# EAGLE design US_balise_2 (EAGLE 5.11)
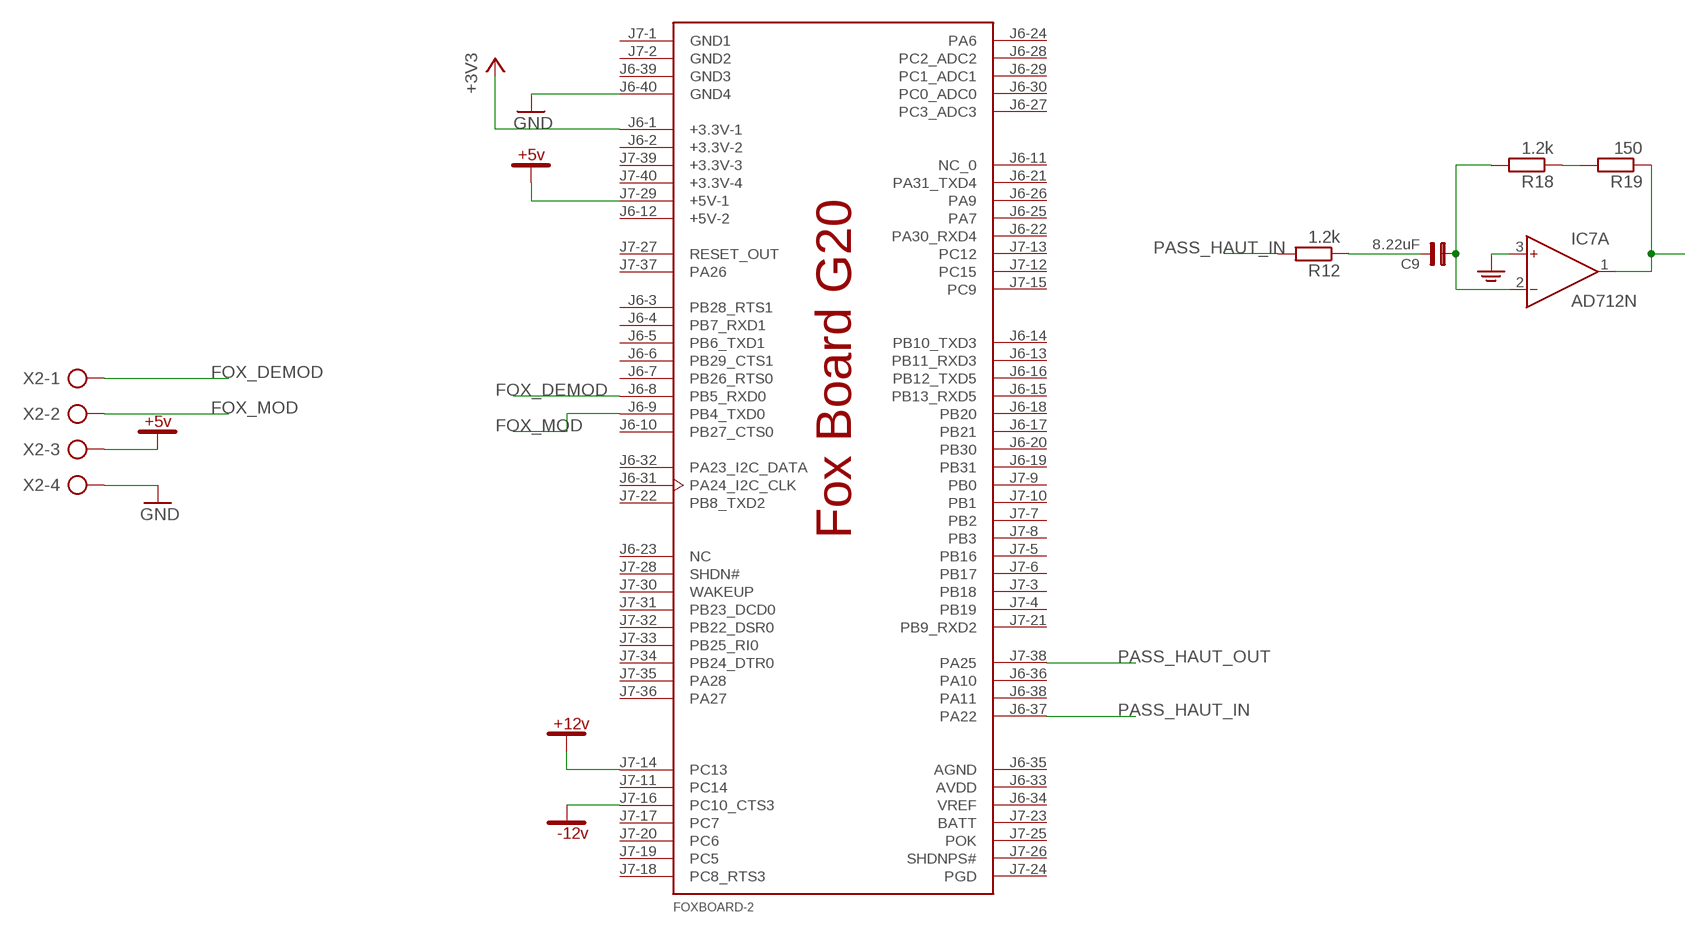
[diagram p0: schematic, sheet 1, part 1 of 2]
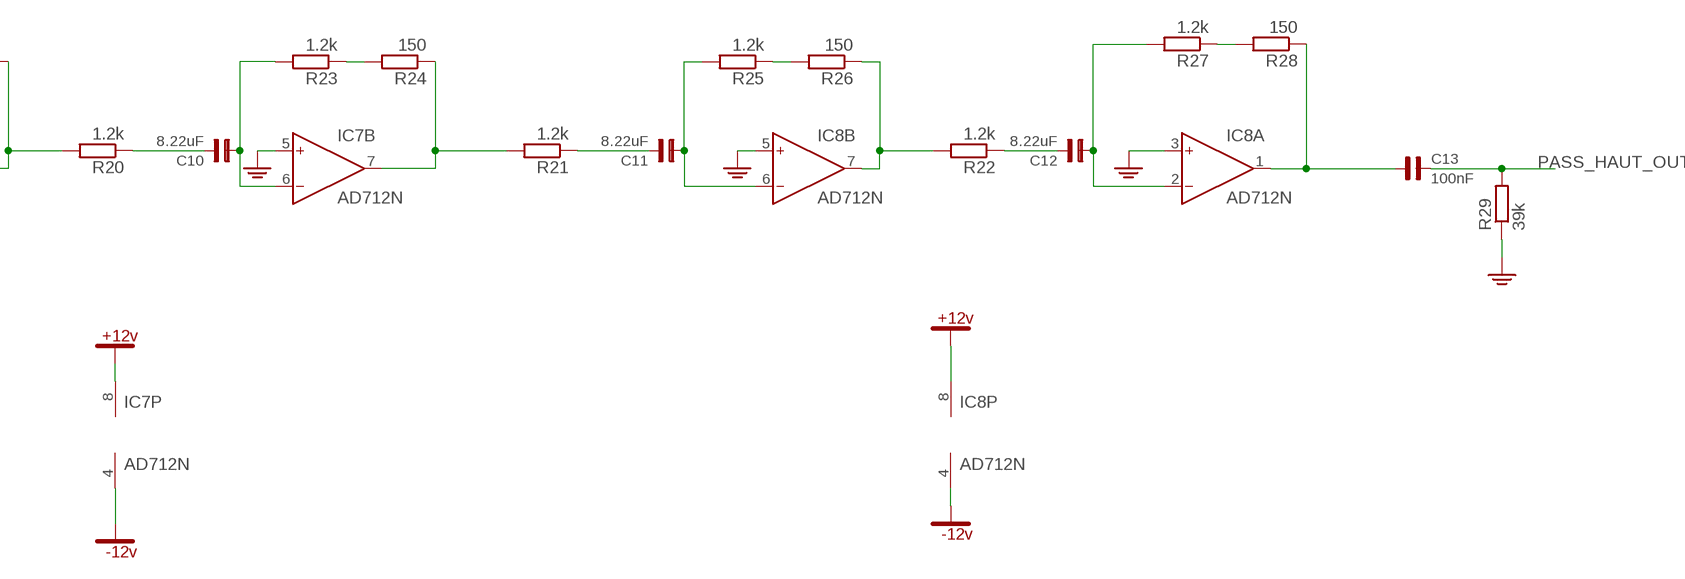
[diagram p1: schematic, sheet 1, part 2 of 2]

## Parts
C9  8.22uF  C5B2,5  [C5B2,5]
C10  8.22uF  C5B2,5  [C5B2,5]
C11  8.22uF  C5B2,5  [C5B2,5]
C12  8.22uF  C5B2,5  [C5B2,5]
C13  100nF  C5B2,5E  [C5B2,5A]
FOXBOARD-2  FOX-BOARD  [FOX-BOARD]
IC7  AD712N  [DIL08]
IC8  AD712N  [DIL08]
R12  1.2k  R-EU_0309/12  [0309/12]
R18  1.2k  R-EU_0309/12  [0309/12]
R19  150  R-EU_0309/12  [0309/12]
R20  1.2k  R-EU_0309/12  [0309/12]
R21  1.2k  R-EU_0309/12  [0309/12]
R22  1.2k  R-EU_0309/12  [0309/12]
R23  1.2k  R-EU_0309/12  [0309/12]
R24  150  R-EU_0309/12  [0309/12]
R25  1.2k  R-EU_0309/12  [0309/12]
R26  150  R-EU_0309/12  [0309/12]
R27  1.2k  R-EU_0309/12  [0309/12]
R28  150  R-EU_0309/12  [0309/12]
R29  39k  R-EU_0309/12  [0309/12]
X2  AK300/4  [AK300/4]

## Nets
+3V3: FOXBOARD-2.J6-1(+3.3V-1)
+5V: FOXBOARD-2.J7-29(+5V-1) X2.3
+12V: FOXBOARD-2.J7-14(PC13) IC7.8(P:V+) IC8.8(P:V+)
-12V: FOXBOARD-2.J7-16(PC10_CTS3) IC7.4(P:V-) IC8.4(P:V-)
FOX_DEMOD: FOXBOARD-2.J6-8(PB5_RXD0) X2.1
FOX_MOD: FOXBOARD-2.J6-9(PB4_TXD0) X2.2
GND: FOXBOARD-2.J6-40(GND4) IC7.3(A:IN+) IC7.5(B:IN+) IC8.3(A:IN+) IC8.5(B:IN+) R29.1 X2.4
N$23: C9.2 R12.1
N$25: C9.1 IC7.2(A:IN-) R18.2
N$27: R18.1 R19.2
N$28: IC7.1(A:OUT) R19.1 R20.2
N$29: C10.2 R20.1
N$30: C10.1 IC7.6(B:IN-) R23.2
N$31: R23.1 R24.2
N$33: IC7.7(B:OUT) R21.2 R24.1
N$34: C11.2 R21.1
N$35: C11.1 IC8.6(B:IN-) R25.2
N$36: R25.1 R26.2
N$37: IC8.7(B:OUT) R22.2 R26.1
N$38: C12.2 R22.1
N$39: C12.1 IC8.2(A:IN-) R27.2
N$40: R27.1 R28.2
N$41: C13.1 IC8.1(A:OUT) R28.1
PASS_HAUT_IN: FOXBOARD-2.J6-37(PA22) R12.2
PASS_HAUT_OUT: C13.2 FOXBOARD-2.J7-38(PA25) R29.2
Unconnected: FOXBOARD-2.J6-3(PB28_RTS1) FOXBOARD-2.J6-4(PB7_RXD1) FOXBOARD-2.J6-5(PB6_TXD1) FOXBOARD-2.J6-6(PB29_CTS1) FOXBOARD-2.J6-7(PB26_RTS0) FOXBOARD-2.J6-10(PB27_CTS0) FOXBOARD-2.J6-11(NC_0) FOXBOARD-2.J6-13(PB11_RXD3) FOXBOARD-2.J6-14(PB10_TXD3) FOXBOARD-2.J6-15(PB13_RXD5) FOXBOARD-2.J6-16(PB12_TXD5) FOXBOARD-2.J6-17(PB21) FOXBOARD-2.J6-18(PB20) FOXBOARD-2.J6-19(PB31) FOXBOARD-2.J6-20(PB30) FOXBOARD-2.J6-21(PA31_TXD4) FOXBOARD-2.J6-22(PA30_RXD4) FOXBOARD-2.J6-23(NC) FOXBOARD-2.J6-24(PA6) FOXBOARD-2.J6-25(PA7) FOXBOARD-2.J6-26(PA9) FOXBOARD-2.J6-27(PC3_ADC3) FOXBOARD-2.J6-28(PC2_ADC2) FOXBOARD-2.J6-29(PC1_ADC1) FOXBOARD-2.J6-30(PC0_ADC0) FOXBOARD-2.J6-31(PA24_I2C_CLK) FOXBOARD-2.J6-32(PA23_I2C_DATA) FOXBOARD-2.J6-33(AVDD) FOXBOARD-2.J6-34(VREF) FOXBOARD-2.J6-35(AGND) FOXBOARD-2.J6-36(PA10) FOXBOARD-2.J6-38(PA11) FOXBOARD-2.J7-3(PB18) FOXBOARD-2.J7-4(PB19) FOXBOARD-2.J7-5(PB16) FOXBOARD-2.J7-6(PB17) FOXBOARD-2.J7-7(PB2) FOXBOARD-2.J7-8(PB3) FOXBOARD-2.J7-9(PB0) FOXBOARD-2.J7-10(PB1) FOXBOARD-2.J7-11(PC14) FOXBOARD-2.J7-12(PC15) FOXBOARD-2.J7-13(PC12) FOXBOARD-2.J7-15(PC9) FOXBOARD-2.J7-17(PC7) FOXBOARD-2.J7-18(PC8_RTS3) FOXBOARD-2.J7-19(PC5) FOXBOARD-2.J7-20(PC6) FOXBOARD-2.J7-21(PB9_RXD2) FOXBOARD-2.J7-22(PB8_TXD2) FOXBOARD-2.J7-23(BATT) FOXBOARD-2.J7-24(PGD) FOXBOARD-2.J7-25(POK) FOXBOARD-2.J7-26(SHDNPS#) FOXBOARD-2.J7-27(RESET_OUT) FOXBOARD-2.J7-28(SHDN#) FOXBOARD-2.J7-30(WAKEUP) FOXBOARD-2.J7-31(PB23_DCD0) FOXBOARD-2.J7-32(PB22_DSR0) FOXBOARD-2.J7-33(PB25_RI0) FOXBOARD-2.J7-34(PB24_DTR0) FOXBOARD-2.J7-35(PA28) FOXBOARD-2.J7-36(PA27) FOXBOARD-2.J7-37(PA26)

## Power pins joined to a net without a drawn wire
+3.3V-2: FOXBOARD-2.J6-2(+3.3V-2)
+3.3V-3: FOXBOARD-2.J7-39(+3.3V-3)
+3.3V-4: FOXBOARD-2.J7-40(+3.3V-4)
+5V-2: FOXBOARD-2.J6-12(+5V-2)
GND1: FOXBOARD-2.J7-1(GND1)
GND2: FOXBOARD-2.J7-2(GND2)
GND3: FOXBOARD-2.J6-39(GND3)

## Library data of the parts
C9-C12 = CAP:C5B2,5
C13 = CAP:C5B2,5E
FOXBOARD-2 = Julien:FOX-BOARD
IC7 IC8 = analog-devices:AD712: Dual Precision, Low Cost, High Speed BiFET Op Amp Source: http://www.analog.com/static/imported-files/data_sheets/AD712.pdf; MF: ALTERA CORPORATION; MPN: AD712JNZ; OC_FARNELL: 9604898; OC_NEWARK: 59K4554
R12 R18-R29 = rcl:R-EU_: RESISTOR, European symbol
X2 = con-ptr500:AK300/4: CONNECTOR; OC_FARNELL: unknown; OC_NEWARK: unknown

## Board
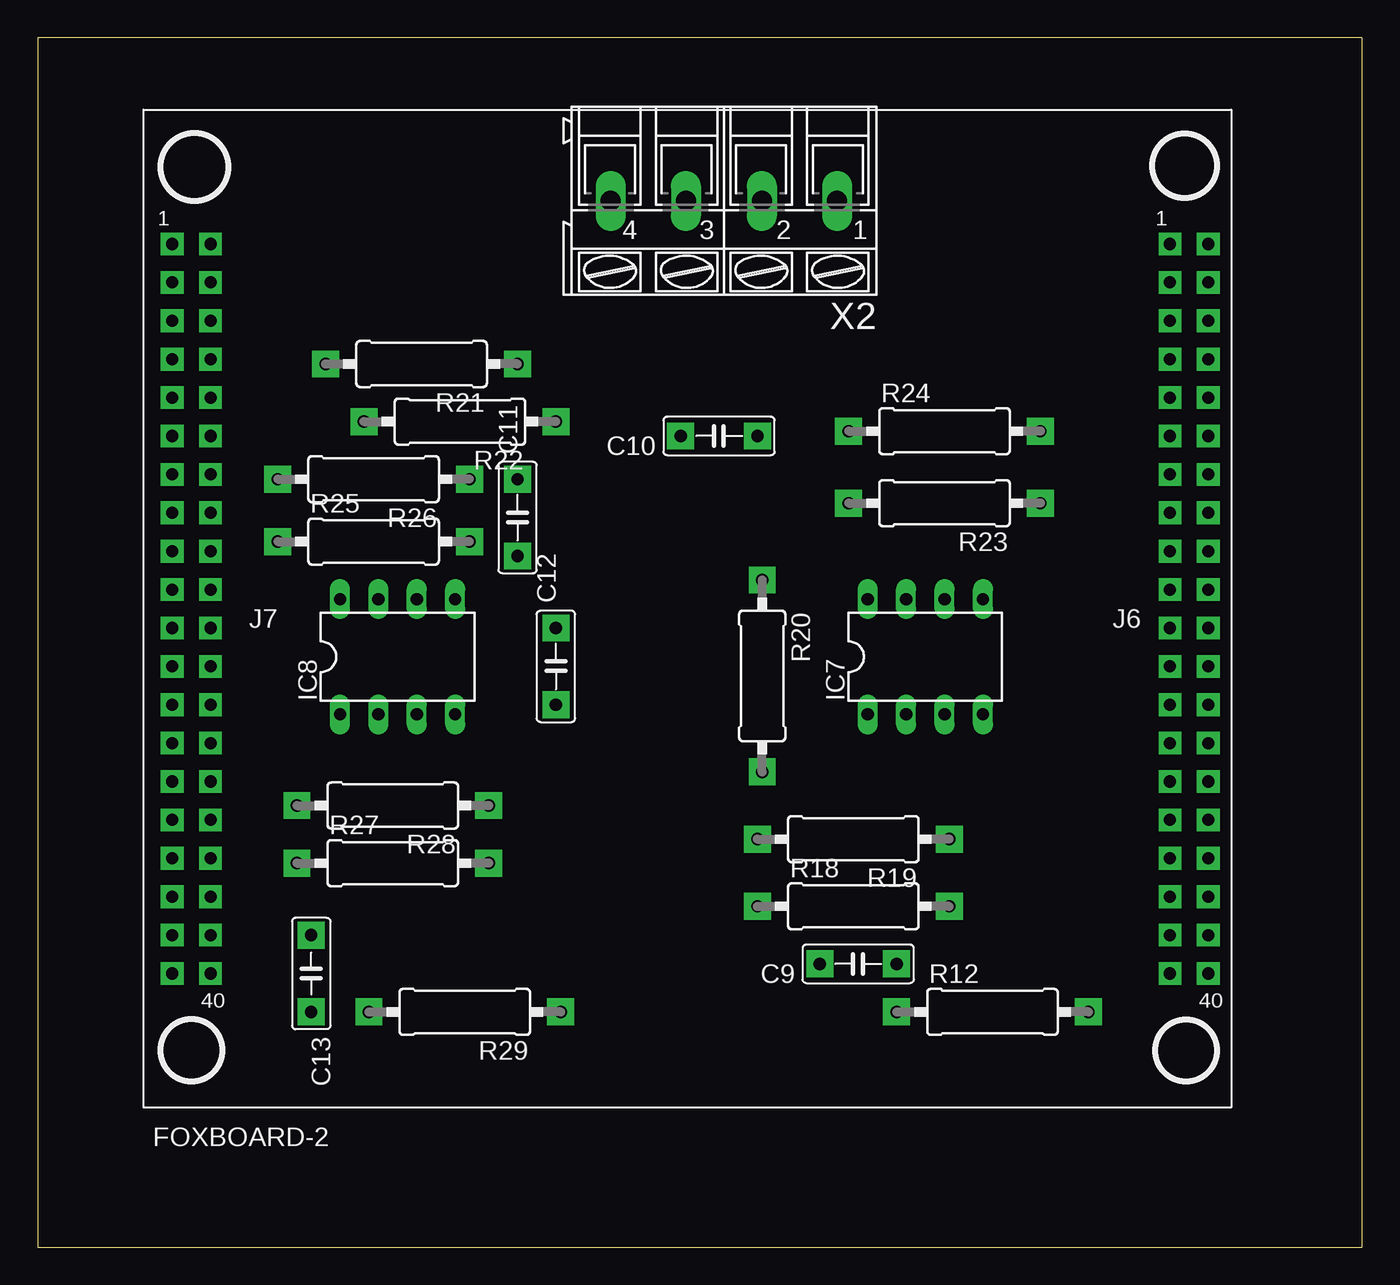
[diagram p2: board, top side]
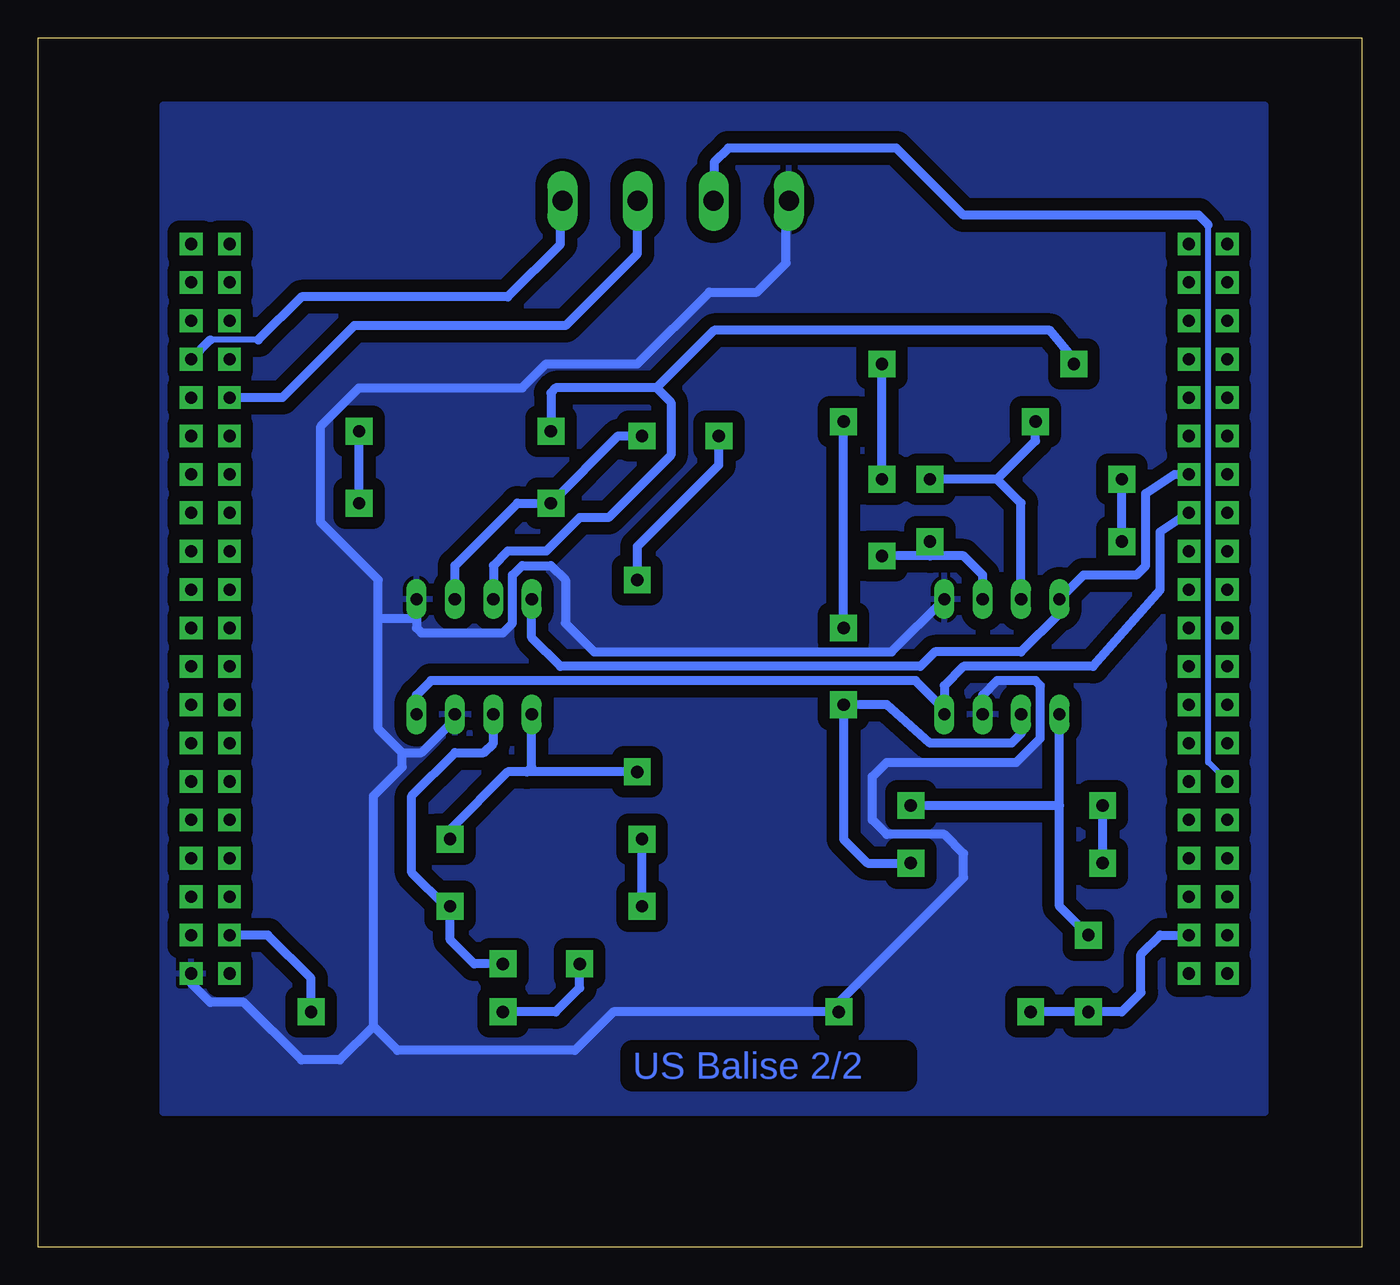
[diagram p3: board, bottom side, seen from below]

Size 87.62 x 80 mm. Coordinates in mm from the lower left corner, seen from the top.
Outline: 0,0 87.62,0 87.62,80 0,80 0,0
Copper layers (1*16): Top 0.035mm / dielectric 1.5mm / Bottom 0.035mm
Design rules "default": minimum track width 10mil, minimum drill 24mil, track to track 8mil, track to pad 8mil, pad to pad 8mil, via to via 8mil, smd to smd 8mil, copper to edge 40mil, drill to drill 8mil, minimum pad ring 10mil, minimum via ring 8mil, stop-mask expansion 4mil, vias tented up to drill 0mil, thermal gap 10mil

### Footprints (pad centres in the part's own frame; a part is rotated, then mirrored left to right if it is on the bottom)
C5B2,5 = drill 0.813 pad 1.778 square: 1 -2.54,0; 2 2.54,0
C5B2,5A = drill 0.813 pad 1.778 square: 1 -2.54,0; 2 2.54,0
FOX-BOARD = drill 0.8 pad 1.5 square: J6-1 31.75,22.86; J6-2 34.29,22.86; J6-3 31.75,20.32; J6-4 34.29,20.32; J6-5 31.75,17.78; J6-6 34.29,17.78; J6-7 31.75,15.24; J6-8 34.29,15.24; J6-9 31.75,12.7; J6-10 34.29,12.7; J6-11 31.75,10.16; J6-12 34.29,10.16; J6-13 31.75,7.62; J6-14 34.29,7.62; J6-15 31.75,5.08; J6-16 34.29,5.08; J6-17 31.75,2.54; J6-18 34.29,2.54; J6-19 31.75,0; J6-20 34.29,0; J6-21 31.75,-2.54; J6-22 34.29,-2.54; J6-23 31.75,-5.08; J6-24 34.29,-5.08; J6-25 31.75,-7.62; J6-26 34.29,-7.62; J6-27 31.75,-10.16; J6-28 34.29,-10.16; J6-29 31.75,-12.7; J6-30 34.29,-12.7; J6-31 31.75,-15.24; J6-32 34.29,-15.24; J6-33 31.75,-17.78; J6-34 34.29,-17.78; J6-35 31.75,-20.32; J6-36 34.29,-20.32; J6-37 31.75,-22.86; J6-38 34.29,-22.86; J6-39 31.75,-25.4; J6-40 34.29,-25.4; J7-1 -34.29,22.86; J7-2 -31.75,22.86; J7-3 -34.29,20.32; J7-4 -31.75,20.32; J7-5 -34.29,17.78; J7-6 -31.75,17.78; J7-7 -34.29,15.24; J7-8 -31.75,15.24; J7-9 -34.29,12.7; J7-10 -31.75,12.7; J7-11 -34.29,10.16; J7-12 -31.75,10.16; J7-13 -34.29,7.62; J7-14 -31.75,7.62; J7-15 -34.29,5.08; J7-16 -31.75,5.08; J7-17 -34.29,2.54; J7-18 -31.75,2.54; J7-19 -34.29,0; J7-20 -31.75,0; J7-21 -34.29,-2.54; J7-22 -31.75,-2.54; J7-23 -34.29,-5.08; J7-24 -31.75,-5.08; J7-25 -34.29,-7.62; J7-26 -31.75,-7.62; J7-27 -34.29,-10.16; J7-28 -31.75,-10.16; J7-29 -34.29,-12.7; J7-30 -31.75,-12.7; J7-31 -34.29,-15.24; J7-32 -31.75,-15.24; J7-33 -34.29,-17.78; J7-34 -31.75,-17.78; J7-35 -34.29,-20.32; J7-36 -31.75,-20.32; J7-37 -34.29,-22.86; J7-38 -31.75,-22.86; J7-39 -34.29,-25.4; J7-40 -31.75,-25.4
DIL08 = drill 0.813 long: 1 -3.81,-3.81; 2 -1.27,-3.81; 3 1.27,-3.81; 4 3.81,-3.81; 5 3.81,3.81; 6 1.27,3.81; 7 -1.27,3.81; 8 -3.81,3.81
0309/12 = drill 0.813 octagon: 1 -6.35,0; 2 6.35,0
AK300/4 = drill 1.321 long: 1 -7.493,0; 2 -2.515,0; 3 2.515,0; 4 7.493,0

### Placement (x,y rotation side)
C9  54.29,18.73 180 top
C10  45.09,53.66 180 top
C11  31.75,48.26 90 top
C12  34.29,38.42 90 top
C13  18.1,18.1 270 top
FOXBOARD-2  43.18,43.5 0 top
IC7  58.74,39.05 0 top
IC8  23.81,39.05 0 top
R12  63.18,15.56 0 top
R18  53.98,22.54 0 top
R19  53.98,26.99 180 top
R20  47.94,37.78 270 top
R21  25.4,58.42 180 top
R22  27.94,54.61 180 top
R23  60.01,49.21 180 top
R24  60.01,53.98 0 top
R25  22.23,46.67 0 top
R26  22.23,50.8 180 top
R27  23.5,25.4 0 top
R28  23.5,29.21 180 top
R29  28.26,15.56 180 top
X2  45.4,69.22 180 top

### Tracks (layer width: path | path; a pad name or v marks a point on that pad's centre or on a via)
+5V
  Bottom 0.406: FOXBOARD-2.J7-29 10.16,32.07 10.16,67.63
  Bottom 0.61: 10.16,67.63 10.79,68.26 26.35,68.26 30.8,72.71 41.91,72.71 42.86,71.75 42.86,69.24 X2.3
+12V
  Bottom 0.61: FOXBOARD-2.J7-14 12.38,51.12 14.29,49.85 14.29,45.09 14.92,44.45 18.41,44.45 IC8.8 20,41.91 22.54,39.37 28.26,39.37 29.21,38.42 53.02,38.42 54.93,40.32 IC7.8
-12V
  Bottom 0.406: IC8.4 27.62,35.56
  Bottom 0.61: 27.62,35.56 29.53,37.47 61.59,37.47 62.55,36.51 IC7.4 | IC8.4 27.62,37.15 26.35,38.42 17.78,38.42 13.34,43.5 13.34,47.31 FOXBOARD-2.J7-16
FOX_DEMOD
  Bottom 0.406: 73.03,60.01 76.2,60.01
  Bottom 0.61: 73.03,60.01 70.17,62.87 56.52,62.87 53.02,66.36 53.02,69.22 X2.1 | 76.2,60.01 FOXBOARD-2.J6-8
FOX_MOD
  Bottom 0.61: FOXBOARD-2.J6-9 71.44,56.2 66.67,60.96 52.7,60.96 47.94,65.72 47.94,69.19 X2.2
GND
  Bottom 0.61: IC8.3 25.08,36.51 24.13,37.47 21.59,37.47 21.27,37.15 21.27,33.66 22.86,32.07 31.43,32.07 32.38,31.11 32.38,28.26 31.43,27.3 27.62,27.3 26.35,26.04 26.35,24.45 34.61,16.19 R29.1 49.53,15.56 52.07,13.02 63.82,13.02 65.41,14.61 | IC8.5 31.11,39.37 50.8,39.37 52.7,41.27 52.7,44.13 53.66,45.09 55.56,45.09 56.2,44.45 56.2,41.27 56.83,40.64 62.23,40.64 62.55,40.96 62.55,41.59 | FOXBOARD-2.J6-40 77.47,17.46 76.2,16.19 73.98,16.19 70.17,12.38 67.63,12.38 65.41,14.61 | 63.5,32.7 63.5,31.75 65.41,29.84 65.41,14.61 | IC7.3 60.01,34.92 62.23,32.7 63.5,32.7 | 65.09,41.59 65.09,34.29 63.5,32.7 | 65.09,41.59 62.55,41.59 | 62.55,41.59 IC7.5 | 65.09,41.59 65.09,44.13 68.9,47.94 68.9,54.29 66.36,56.83 55.56,56.83 53.98,58.42 47.94,58.42 43.18,63.18 40.01,63.18 38.1,65.09 38.1,69.03 X2.4
  pour Bottom (isolate 0.813): 6.35,75.56 79.38,75.56 79.38,8.89 6.35,8.89
N$1  (via drill 0.5 pad 1.78)
  other vias: 34.61,15.56
N$2  (via drill 0.5 pad 1.78)
  other vias: 29.84,29.21
N$3  (via drill 0.5 pad 1.78)
  other vias: 21.91,15.56
N$4  (via drill 0.5 pad 1.78)
  other vias: 47.62,26.99
N$5  (via drill 0.5 pad 1.78)
  other vias: 17.14,29.21
N$6  (via drill 0.5 pad 1.78)
  other vias: 29.84,25.4
N$7  (via drill 0.5 pad 1.78)
  other vias: 17.14,25.4
N$8  (via drill 0.5 pad 1.78)
  other vias: 47.94,44.13
N$9  (via drill 0.5 pad 1.78)
  other vias: 47.62,53.66
N$10  (via drill 0.5 pad 1.78)
  other vias: 60.33,26.99
N$11  (via drill 0.5 pad 1.78)
  other vias: 60.33,22.54
N$12  (via drill 0.5 pad 1.78)
  other vias: 56.83,15.56
N$13  (via drill 0.5 pad 1.78)
  other vias: 47.62,22.54
N$14  (via drill 0.5 pad 1.78)
  other vias: 66.36,53.98
N$15  (via drill 0.5 pad 1.78)
  other vias: 19.05,58.42
N$16  (via drill 0.5 pad 1.78)
  other vias: 15.88,50.8
N$17  (via drill 0.5 pad 1.78)
  other vias: 21.59,54.61
N$18  (via drill 0.5 pad 1.78)
  other vias: 28.57,50.8
N$19  (via drill 0.5 pad 1.78)
  other vias: 28.57,46.67
N$20  (via drill 0.5 pad 1.78)
  other vias: 31.75,58.42
N$21  (via drill 0.5 pad 1.78)
  other vias: 34.29,54.61
N$22  (via drill 0.5 pad 1.78)
  other vias: 15.88,46.67
N$23
  Bottom 0.61: R12.1 53.34,15.56 51.75,17.14 C9.2
N$24  (via drill 0.5 pad 1.78)
  other vias: 18.1,20.64
N$25
  Bottom 0.61: C9.1 58.74,18.73 60.33,20.32 R18.2 60.64,22.54 62.87,24.77 62.87,29.84 60.01,32.7 58.1,32.7 57.47,33.34 IC7.2
N$26  (via drill 0.5 pad 1.78)
  other vias: 18.1,15.56
N$27
  Bottom 0.61: R18.1 R19.2
N$28
  Bottom 0.61: R19.1 60.33,27.62 56.52,31.43 55.24,31.43 | R20.2 55.24,31.43 | IC7.1 54.93,31.75 55.24,31.43
N$29
  Bottom 0.61: C10.2 42.55,51.75 47.94,46.35 R20.1
N$30
  Bottom 0.61: C10.1 49.21,53.66 R23.2 55.88,49.21 60.01,45.09 IC7.6
N$31
  Bottom 0.61: R23.1 R24.2
N$32  (via drill 0.5 pad 1.78)
  other vias: 69.53,15.56
N$33
  Bottom 0.406: R21.2 19.05,58.74
  Bottom 0.61: R24.1 53.66,56.52 53.34,56.83 46.67,56.83 | 46.67,56.83 45.72,55.88 45.72,52.39 49.85,48.26 51.75,48.26 53.98,46.04 56.52,46.04 57.47,45.09 IC7.7 | 19.05,58.74 20.64,60.64 42.86,60.64 46.67,56.83
N$34
  Bottom 0.61: C11.2 R21.1
N$35
  Bottom 0.61: 28.57,45.72 C11.1 | 28.57,45.72 R25.2 | 28.57,45.72 26.35,45.72 25.08,44.45 IC8.6
N$36
  Bottom 0.61: R25.1 R26.2
N$37
  Bottom 0.61: 24.13,50.8 R26.1 | 24.13,50.8 22.54,49.21 IC8.7 | 24.13,50.8 21.59,53.34 R22.2
N$38
  Bottom 0.61: C12.2 R22.1
N$39
  Bottom 0.61: IC8.2 22.54,33.97 23.18,33.34 28.57,33.34 31.43,35.88 C12.1 34.29,26.99 32.7,25.4 R27.2
N$40
  Bottom 0.61: R27.1 R28.2
N$41
  Bottom 0.406: IC8.1 20,33.34
  Bottom 0.61: 20,29.21 IC8.1 | 20,29.21 R28.1 | 20,29.21 20,22.54 C13.1
N$42  (via drill 0.5 pad 1.78)
  other vias: 47.94,31.43
N$43  (via drill 0.5 pad 1.78)
  other vias: 53.66,49.21
N$44  (via drill 0.5 pad 1.78)
  other vias: 53.66,53.98
N$45  (via drill 0.5 pad 1.78)
  other vias: 66.36,49.21
N$46  (via drill 0.5 pad 1.78)
  other vias: 56.83,18.73
N$47  (via drill 0.5 pad 1.78)
  other vias: 34.29,40.96
N$48  (via drill 0.5 pad 1.78)
  other vias: 42.55,53.66
N$49  (via drill 0.5 pad 1.68)
  other vias: 52.96,69.22
N$51  (via drill 0.5 pad 1.68)
  other vias: 37.91,69.22
N$52  (via drill 0.5 pad 1.68)
  other vias: 42.86,69.22
N$53  (via drill 0.5 pad 1.68)
  other vias: 47.94,69.22
N$54  (via drill 0.5 pad 1.78)
  other vias: 31.75,50.8
N$55  (via drill 0.5 pad 1.78)
  other vias: 51.75,18.73
N$57  (via drill 0.5 pad 1.78)
  other vias: 31.75,45.72
PASS_HAUT_IN
  Bottom 0.61: FOXBOARD-2.J6-37 72.39,20.64 69.53,17.78 R12.2
PASS_HAUT_OUT
  Bottom 0.61: FOXBOARD-2.J7-38 13.34,20.64 14.61,19.37 14.61,16.83 15.88,15.56 C13.2 R29.2

### Text on the board
Bottom: US Balise 2/2